# EAGLE schematic emitter follower_v2_punto di lavoro (EAGLE 9.6.2)
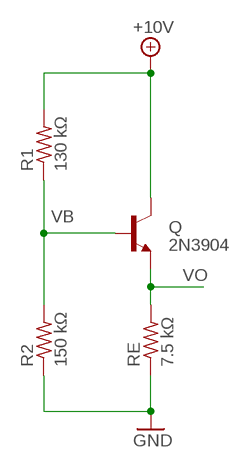
[diagram p0: schematic, sheet 1]

## Parts
Q  2N3904  [TO92]
R1  130 kΩ  R-US_0204/5  [0204/5]
R2  150 kΩ  R-US_0204/5  [0204/5]
RE  7.5 kΩ  R-US_0204/5  [0204/5]

## Nets
+10V: Q.1(C) R1.2
GND: R2.1 RE.1
N$3: Q.2(B) R1.1 R2.2
VO: Q.3(E) RE.2

## Notes on the sheet
- VB

## Library data of the parts
Q = transistor:2N3904: NPN TRANSISTOR
R1 R2 RE = rcl:R-US_: RESISTOR, American symbol; SPICEPREFIX: R